# EAGLE design vote_box (EAGLE 7.4.0)
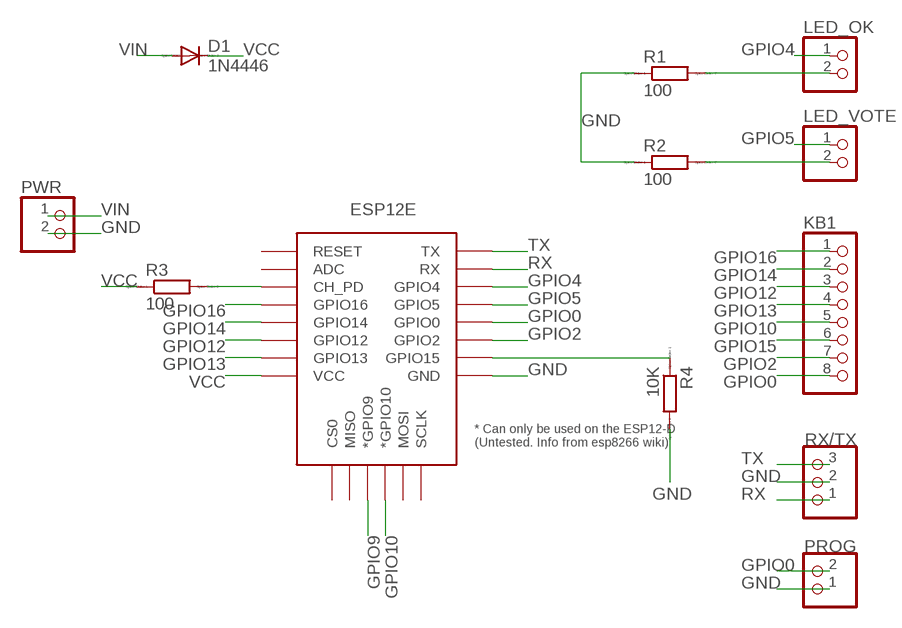
[diagram p0: schematic, sheet 1]

## Parts
D1  1N4446  [DO35-10]
ESP12E  ESP12ESMD  [ESP12E-SMD]
KB1  PINHD-1X8  [1X08]
LED_OK  PINHD-1X2  [1X02]
LED_VOTE  PINHD-1X2  [1X02]
PROG  PINHD-1X2  [1X02]
PWR  PINHD-1X2  [1X02]
R1  100  R0207/10  [0207/10]
R2  100  R0207/10  [0207/10]
R3  100  R0207/10  [0207/10]
R4  10K  R0207/10  [0207/10]
RX/TX  PINHD-1X3  [1X03]

## Nets
GND: ESP12E.GND PROG.1 PWR.2 R1.1 R2.1 R4.2 RX/TX.2
GPIO0: ESP12E.GPIO0 KB1.8 PROG.2
GPIO2: ESP12E.GPIO2 KB1.7
GPIO4: ESP12E.GPIO4 LED_OK.1
GPIO5: ESP12E.GPIO5 LED_VOTE.1
GPIO9: ESP12E.GPIO9(*GPIO9)
GPIO10: ESP12E.GPIO10(*GPIO10) KB1.5
GPIO12: ESP12E.GPIO12 KB1.3
GPIO13: ESP12E.GPIO13 KB1.4
GPIO14: ESP12E.GPIO14 KB1.2
GPIO15: ESP12E.GPIO15 KB1.6 R4.1
GPIO16: ESP12E.GPIO16 KB1.1
N$2: ESP12E.CH_PD R3.2
N$30: LED_VOTE.2 R2.2
N$33: LED_OK.2 R1.2
RX: ESP12E.RXD0(RX) RX/TX.1
TX: ESP12E.TXD0(TX) RX/TX.3
VCC: D1.C ESP12E.VCC R3.1
VIN: D1.A PWR.1
Unconnected: ESP12E.ADC ESP12E.CS0 ESP12E.MISO ESP12E.MOSI ESP12E.RESET ESP12E.SCLK

## Library data of the parts
D1 = diode:1N4446: DIODE high speed (Philips)
ESP12E = esp8266modules:ESP12E: ESP12E Module
KB1 = pinhead:PINHD-1X8: PIN HEADER
LED_OK LED_VOTE PROG PWR = pinhead:PINHD-1X2: PIN HEADER
R1-R4 = eagle-ltspice:R: RESISTOR, European symbol; SPICEMODEL: NONE; SPICEPREFIX: R
RX/TX = pinhead:PINHD-1X3: PIN HEADER

## Board
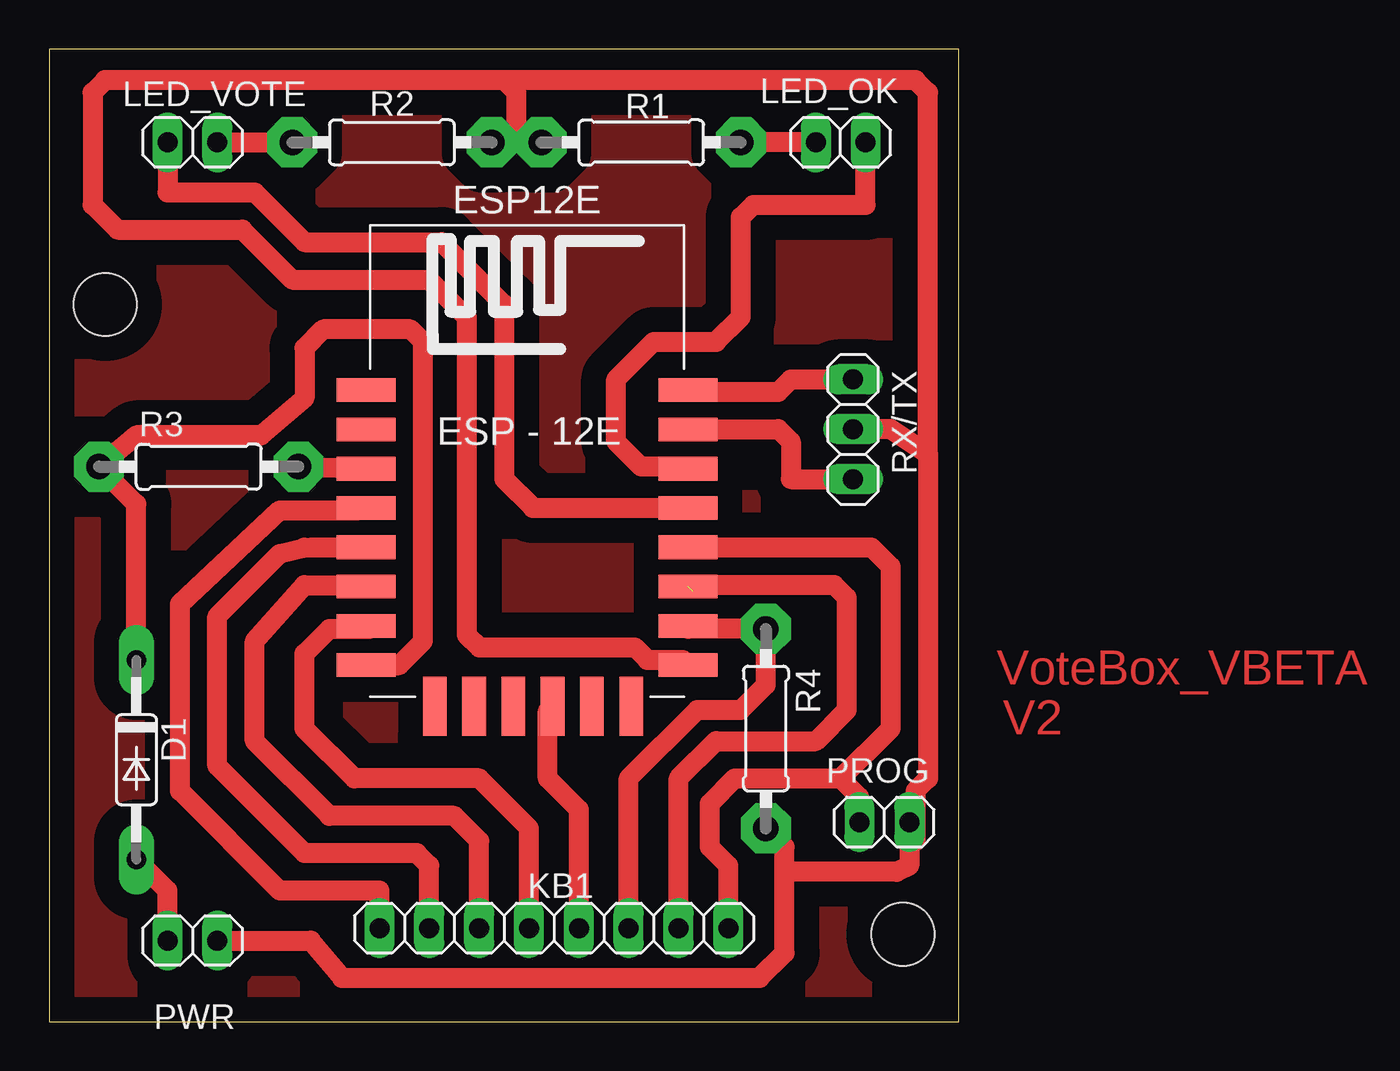
[diagram p1: board, top side]

Size 46.34 x 49.52 mm. Coordinates in mm from the lower left corner, seen from the top.
Outline: 0,0 46.34,0 46.34,49.52 0,49.52 0,0
Copper layers (1*16): Top 0.035mm / dielectric 1.5mm / Bottom 0.035mm
Design rules "default": minimum track width 10mil, minimum drill 24mil, track to track 8mil, track to pad 8mil, pad to pad 8mil, via to via 8mil, smd to smd 8mil, copper to edge 40mil, drill to drill 8mil, minimum pad ring 10mil, minimum via ring 8mil, stop-mask expansion 4mil, vias tented up to drill 0mil, thermal gap 10mil
Holes 3.2 mm at 2.86,36.51 43.5,4.45

### Footprints (pad centres in the part's own frame; a part is rotated, then mirrored left to right if it is on the bottom)
DO35-10 = drill 1 pad 1.778 long: A 5.08,0; C -5.08,0
ESP12E-SMD = smd 3 x 1.2: ADC -8.3,3.8; CH_PD -8.3,1.8; GND 8.1,-8.2; GPIO0 8.1,-2.2; GPIO2 8.1,-4.2; GPIO4 8.1,1.8; GPIO5 8.1,-0.2; GPIO12 -8.3,-4.2; GPIO13 -8.3,-6.2; GPIO14 -8.3,-2.2; GPIO15 8.1,-6.2; GPIO16 -8.3,-0.2; RESET -8.3,5.8; RXD0 8.1,3.8; TXD0 8.1,5.8; VCC -8.3,-8.2 | smd 1.2 x 3: CS0 -4.8,-10.3; GPIO9 -0.8,-10.3; GPIO10 1.2,-10.3; MISO -2.8,-10.3; MOSI 3.2,-10.3; SCLK 5.2,-10.3
1X08 = drill 1.016 long: 1 -8.89,0; 2 -6.35,0; 3 -3.81,0; 4 -1.27,0; 5 1.27,0; 6 3.81,0; 7 6.35,0; 8 8.89,0
1X02 = drill 1.016 long: 1 -1.27,0; 2 1.27,0
0207/10 = drill 1.3 pad 2.54 octagon: 1 -5.08,0; 2 5.08,0
1X03 = drill 1.016 long: 1 -2.54,0; 2 0,0; 3 2.54,0

### Placement (x,y rotation side)
D1  4.45,13.34 270 top
ESP12E  24.45,26.35 0 top
KB1  25.72,4.76 0 top
LED_OK  40.32,44.77 180 top
LED_VOTE  7.3,44.77 0 top
PROG  42.55,10.16 180 top
PWR  7.3,4.13 0 top
R1  30.16,44.77 0 top
R2  17.46,44.77 180 top
R3  7.62,28.26 0 top
R4  36.51,14.92 270 top
RX/TX  40.96,30.16 90 top

### Tracks (layer width: path | path; a pad name or v marks a point on that pad's centre or on a via)
GND
  Top 1.016: 44.77,28.89 42.86,30.16 RX/TX.2 | 23.81,44.77 R2.1 | R1.1 23.81,44.77 | 23.81,44.77 23.81,47.31 23.18,47.94 | 23.18,47.94 2.86,47.94 2.22,47.31 2.22,41.59 3.49,40.32 9.84,40.32 12.38,37.78 19.37,37.78 21.27,35.88 21.27,19.68 21.91,19.05 29.84,19.05 30.48,18.41 32.28,18.41 ESP12E.GND | 44.77,28.89 44.77,47.31 44.13,47.94 23.18,47.94 | PWR.2 13.34,4.13 14.92,2.22 36.2,2.22 37.47,3.49 37.47,7.62 | 37.47,7.62 37.47,8.89 R4.2 | 44.77,28.89 44.77,12.38 44.13,11.75 44.13,9.21 PROG.1 43.81,7.94 43.18,7.62 37.47,7.62
GPIO0
  Top 1.016: KB1.8 34.61,7.94 33.66,8.89 33.66,11.11 34.92,12.38 40.32,12.38 | 40.32,12.38 41.27,11.43 PROG.2 | ESP12E.GPIO0 41.89,24.15 42.86,23.18 42.86,14.92 40.32,12.38
GPIO2  (1 unrouted)
  Top 1.016: KB1.7 32.07,12.38 33.97,14.29 39.05,14.29 40.64,15.88 40.64,21.59 40.01,22.23 32.62,22.23 ESP12E.GPIO2
GPIO4
  Top 1.016: ESP12E.GPIO4 32.65,28.26 | 32.65,28.26 32.7,28.26 | 32.65,28.26 30.16,28.26 28.89,29.53 28.89,32.7 30.8,34.61 33.97,34.61 35.24,35.88 35.24,40.96 35.88,41.59 41.59,41.59 LED_OK.1
GPIO5
  Top 1.016: LED_VOTE.1 6.03,42.23 10.48,42.23 13.02,39.69 20,39.69 23.18,36.51 23.18,27.62 24.65,26.15 ESP12E.GPIO5
GPIO10
  Top 1.016: KB1.5 26.99,10.79 25.4,12.38 25.4,15.8 ESP12E.GPIO10
GPIO12
  Top 1.016: KB1.3 21.91,9.21 20.64,10.48 14.29,10.48 10.48,14.29 10.48,19.37 13.02,22.23 15.9,22.23 ESP12E.GPIO12
GPIO13
  Top 1.016: KB1.4 24.45,9.84 21.91,12.38 15.56,12.38 13.02,14.92 13.02,18.73 14.29,20 16.32,20 ESP12E.GPIO13
GPIO14
  Top 1.016: KB1.2 19.37,7.94 18.73,8.57 13.02,8.57 8.57,13.02 8.57,20.64 11.75,23.81 13.02,24.13 13.36,24.15 ESP12E.GPIO14
GPIO15
  Top 1.016: ESP12E.GPIO15 32.55,20 R4.1 36.51,17.14 35.24,15.88 33.02,15.88 29.53,12.38 KB1.6
GPIO16
  Top 1.016: KB1.1 16.83,6.67 11.75,6.67 6.67,11.75 6.67,21.27 11.75,26.04 15.71,26.04 ESP12E.GPIO16
N$1
  pour Top (isolate 1.27): 0,49.53 46.04,49.53 46.04,0 0,0
N$2
  Top 1.016: R3.2 13.08,28.26 ESP12E.CH_PD
N$30
  Top 1.016: LED_VOTE.2 R2.2
N$33
  Top 1.016: LED_OK.2 R1.2
RX
  Top 1.016: ESP12E.RXD0 32.56,30.16 37.15,30.16 37.78,29.53 37.78,27.62 RX/TX.1
TX
  Top 1.016: ESP12E.TXD0 32.63,32.07 37.15,32.07 37.78,32.7 RX/TX.3
VCC
  Top 1.016: ESP12E.VCC 17.84,18.15 19.05,19.37 19.05,34.61 18.41,35.24 13.97,35.24 13.02,34.29 13.02,31.75 10.79,29.84 4.45,29.84 R3.1 4.45,26.35 D1.C
VIN
  Top 1.016: PWR.1 6.03,6.67 D1.A

### Text on the board
Top: VoteBox_VBETA | V2
Reference: Pin 16 | Pin 14 | Pin 12 | Pin 13 | Pin 10 | Pin 15 | Pin 2 | Pin 0